# Altium schematic sheet COEXPIX connectors schematics.SchDoc
size A4
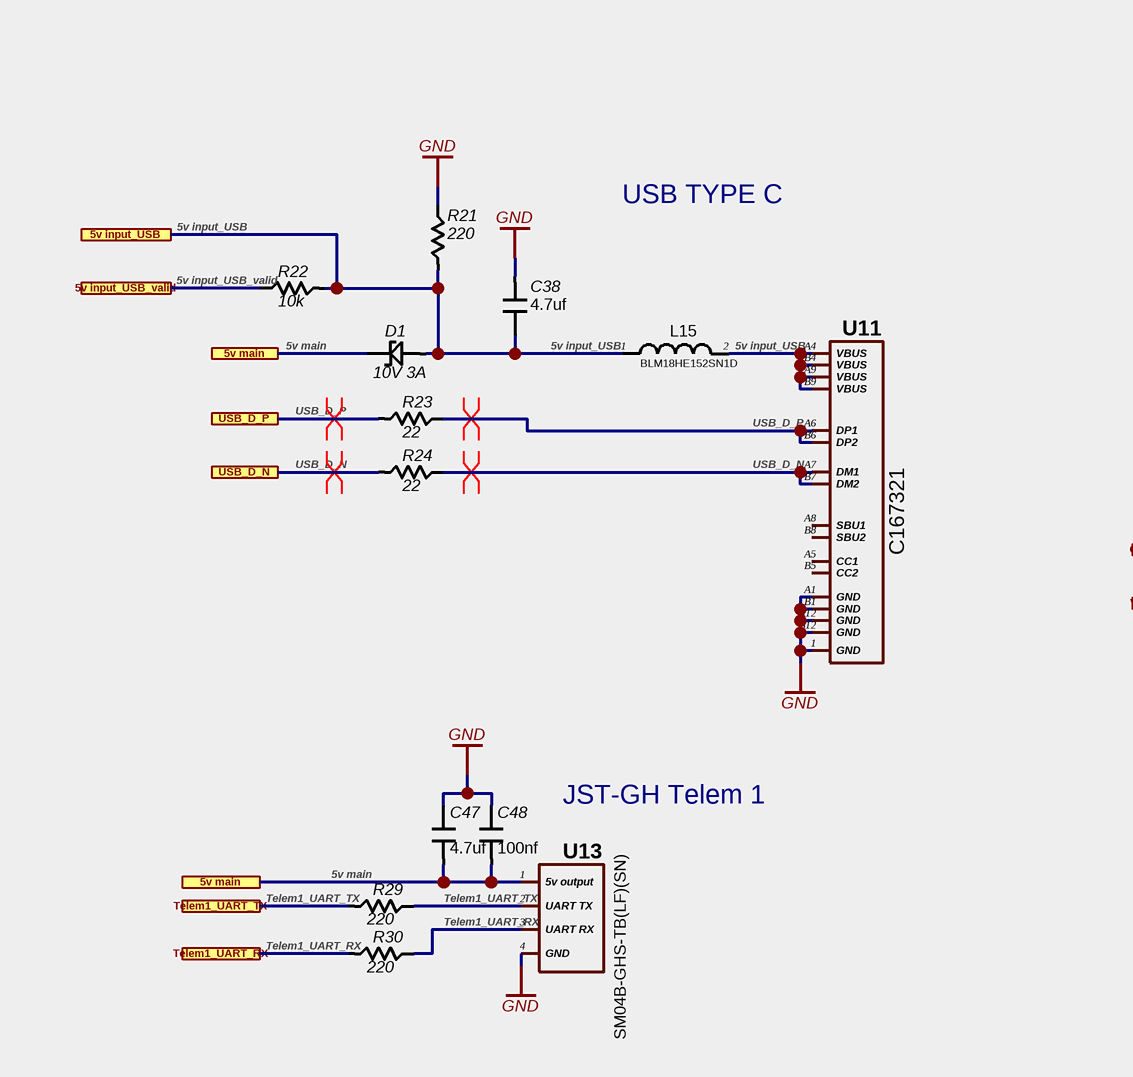
[diagram p0: COEXPIX connectors schematics.SchDoc, top left]
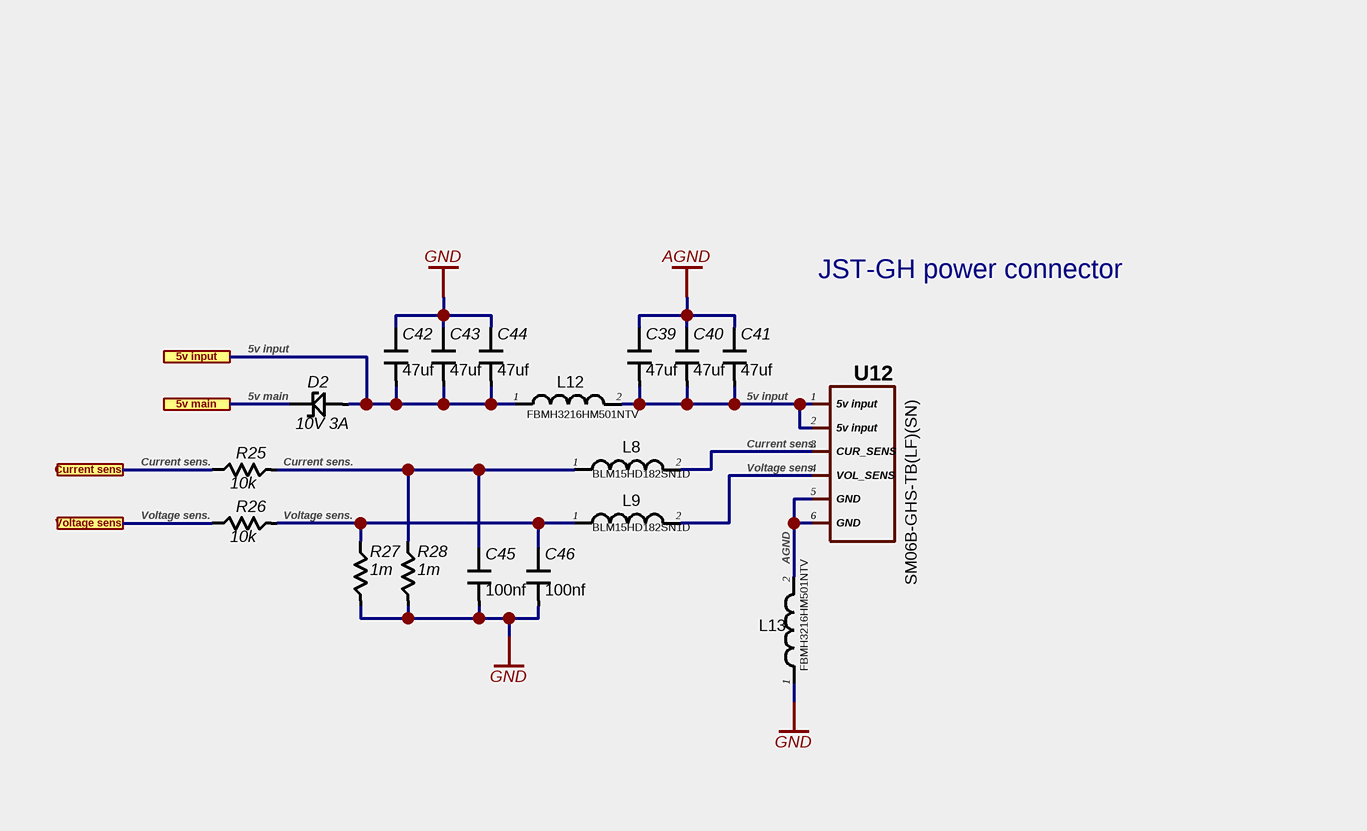
[diagram p1: COEXPIX connectors schematics.SchDoc, top right]
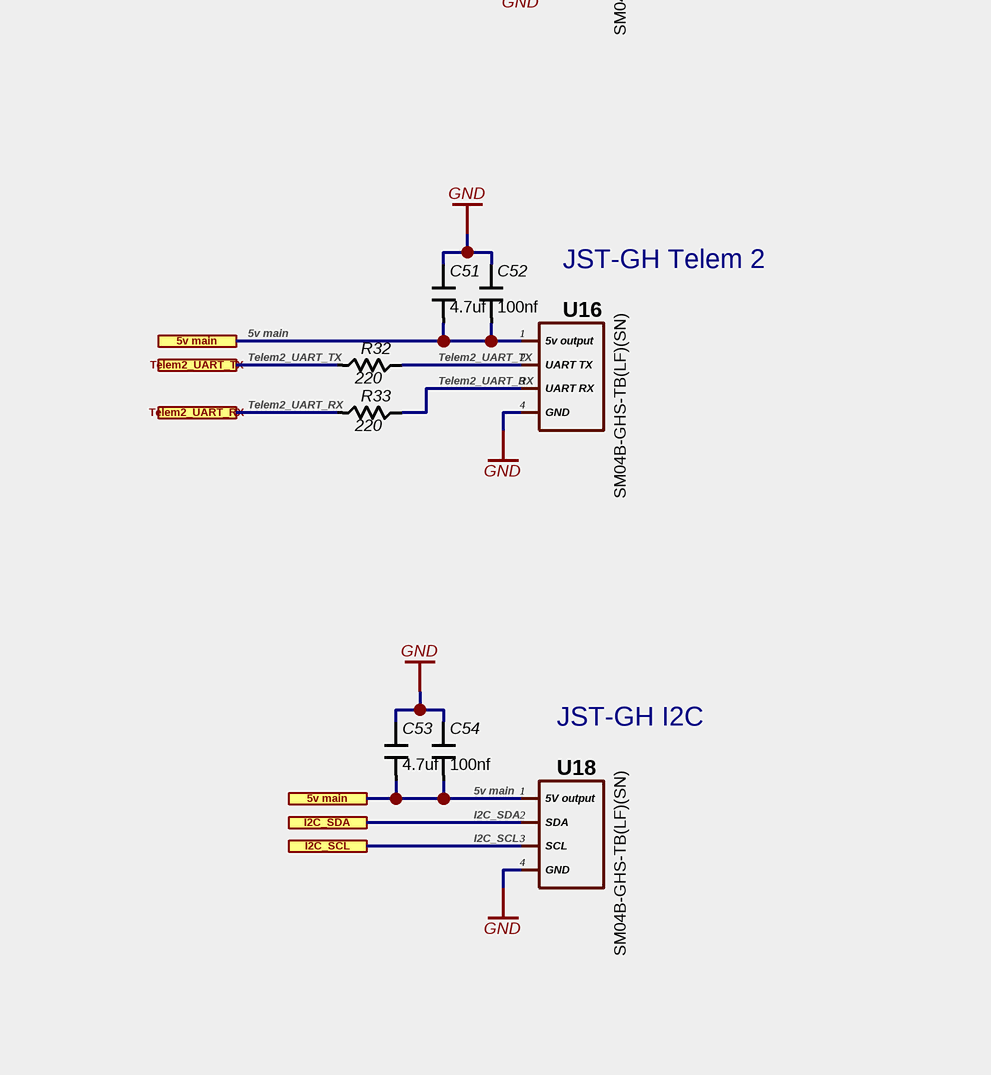
[diagram p2: COEXPIX connectors schematics.SchDoc, bottom left]
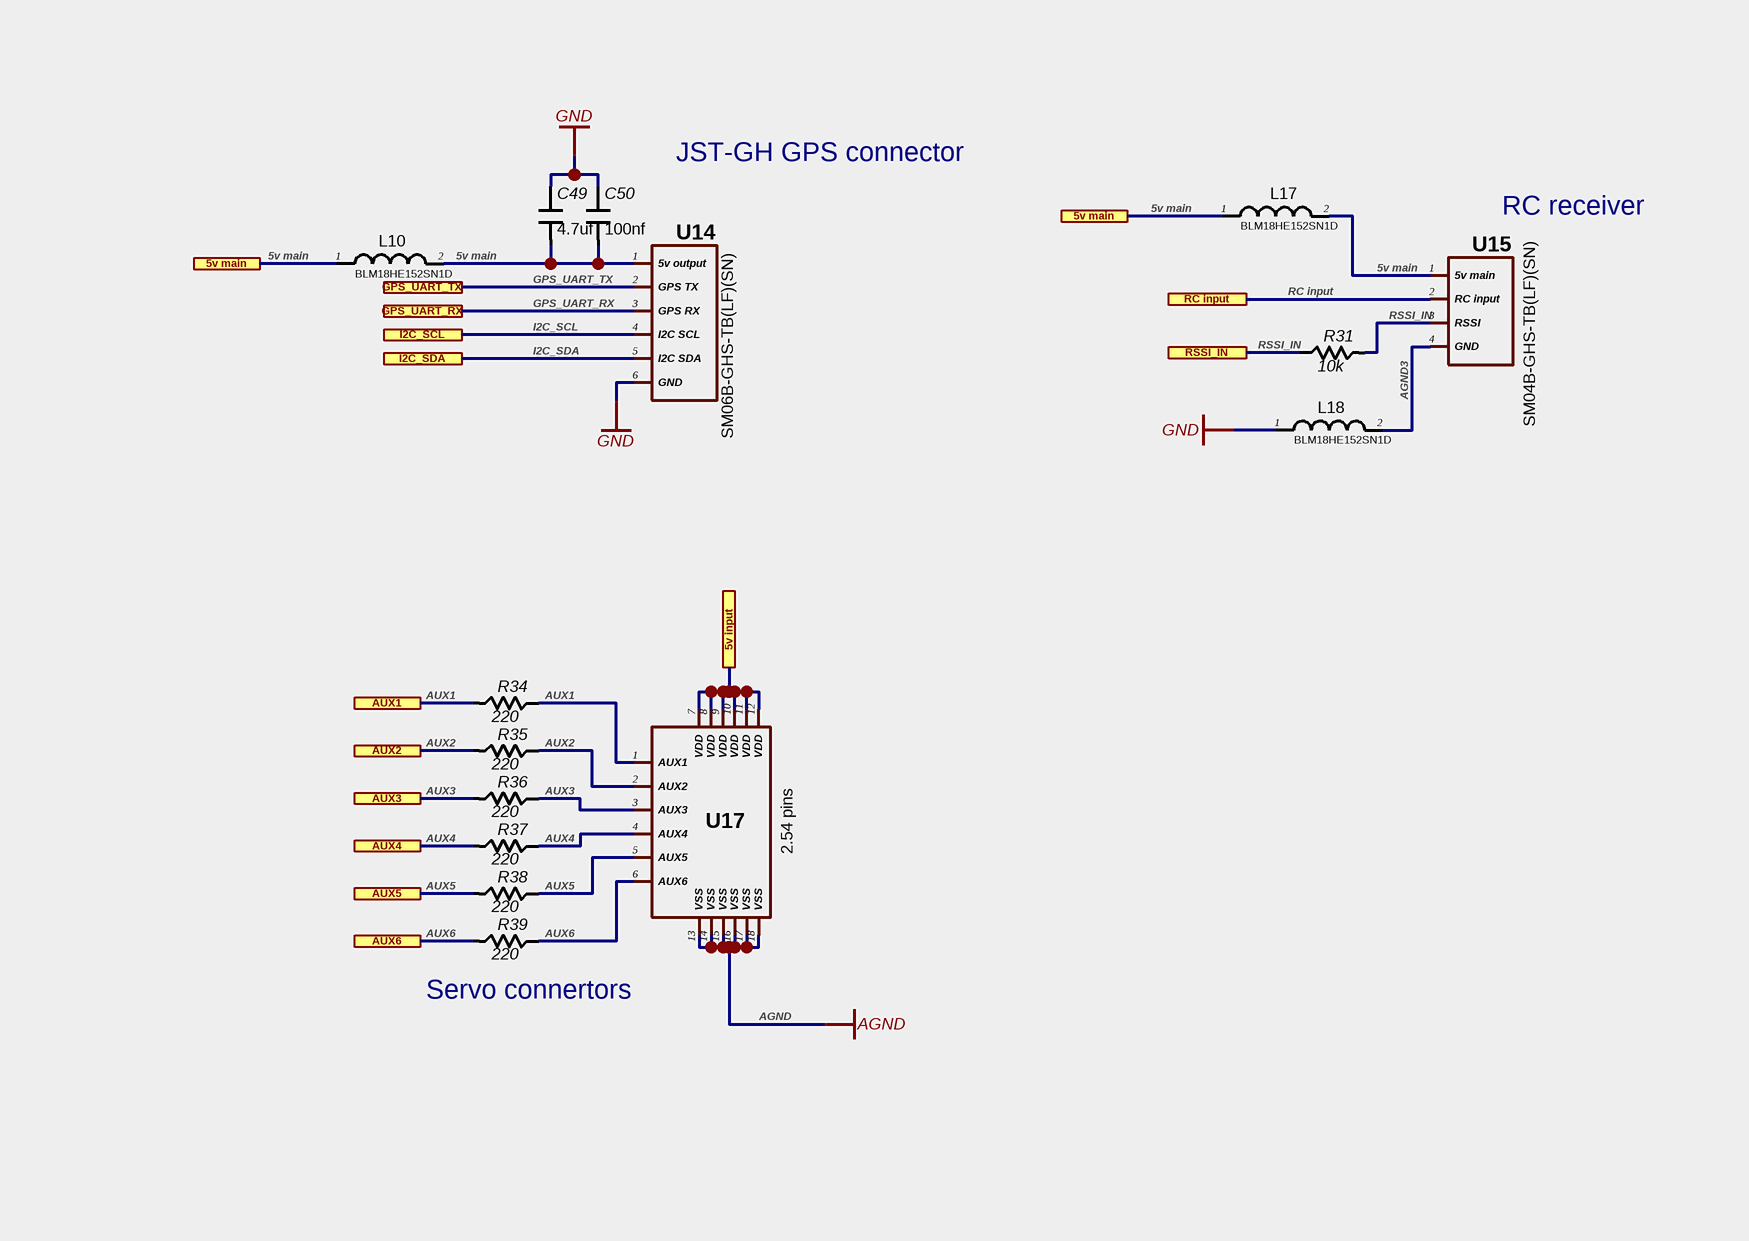
[diagram p3: COEXPIX connectors schematics.SchDoc, bottom right]

## Parts
C38  4.7uf  [Capasitor 0402]
C39  47uf  [Capasitor 0603]
C40  47uf  [Capasitor 0603]
C41  47uf  [Capasitor 0603]
C42  47uf  [Capasitor 0603]
C43  47uf  [Capasitor 0603]
C44  47uf  [Capasitor 0603]
C45  100nf  [Capasitor 0402]
C46  100nf  [Capasitor 0402]
C47  4.7uf  [Capasitor 0402]
C48  100nf  [Capasitor 0402]
C49  4.7uf  [Capasitor 0402]
C50  100nf  [Capasitor 0402]
C51  4.7uf  [Capasitor 0402]
C52  100nf  [Capasitor 0402]
C53  4.7uf  [Capasitor 0402]
C54  100nf  [Capasitor 0402]
D1  10V 3A  [SOD-323F]
D2  10V 3A  [SOD-323F]
L8  BLM15HD182SN1D  [Ferrite bead 0402]
L9  BLM15HD182SN1D  [Ferrite bead 0402]
L10  BLM18HE152SN1D  [Ferrite bead 0603]
L12  FBMH3216HM501NTV  [FERRITE BEAD 1206]
L13  FBMH3216HM501NTV  [FERRITE BEAD 1206]
L15  BLM18HE152SN1D  [Ferrite bead 0603]
L17  BLM18HE152SN1D  [Ferrite bead 0603]
L18  BLM18HE152SN1D  [Ferrite bead 0603]
R21  220  [Resistor 0402]
R22  10k  [Resistor 0402]
R23  22  [Resistor 0402]
R24  22  [Resistor 0402]
R25  10k  [Resistor 0402]
R26  10k  [Resistor 0402]
R27  1m  [Resistor 0402]
R28  1m  [Resistor 0402]
R29  220  [Resistor 0402]
R30  220  [Resistor 0402]
R31  10k  [Resistor 0402]
R32  220  [Resistor 0402]
R33  220  [Resistor 0402]
R34  220  [Resistor 0402]
R35  220  [Resistor 0402]
R36  220  [Resistor 0402]
R37  220  [Resistor 0402]
R38  220  [Resistor 0402]
R39  220  [Resistor 0402]
U11  C167321  [USB TYPE C]
U12  SM06B-GHS-TB(LF)(SN)  [JST-GH 6 PIN]
U13  SM04B-GHS-TB(LF)(SN)  [JST-GH 4 pin]
U14  SM06B-GHS-TB(LF)(SN)  [JST-GH 6 PIN]
U15  SM04B-GHS-TB(LF)(SN)  [JST-GH 4 pin]
U16  SM04B-GHS-TB(LF)(SN)  [JST-GH 4 pin]
U17  2.54 pins  [3x6 PX4 servo array]
U18  SM04B-GHS-TB(LF)(SN)  [JST-GH 4 pin]

## Ports
5v input, 5v input_USB, 5v input_USB_valid, 5v main, AUX1, AUX2, AUX3, AUX4, AUX5, AUX6, Current sens., GPS_UART_RX, GPS_UART_TX, I2C_SCL, I2C_SDA, RC input, RSSI_IN, Telem1_UART_RX, Telem1_UART_TX, Telem2_UART_RX, Telem2_UART_TX, USB_D_N, USB_D_P, Voltage sens.

## Nets
AGND: C39.1 C40.1 C41.1 L13.2 U12.5(GND) U12.6(GND) U17.13(VSS) U17.14(VSS) U17.15(VSS) U17.16(VSS) U17.17(VSS) U17.18(VSS)
GND: C38.2 C42.1 C43.1 C44.1 C45.2 C46.2 C47.1 C48.1 C49.1 C50.1 C51.1 C52.1 C53.1 C54.1 L13.1 L18.1 R21.1 R27.2 R28.2 U11.1(GND) U11.A1(GND) U11.A12(GND) U11.B1(GND) U11.B12(GND) U13.4(GND) U14.6(GND) U16.4(GND) U18.4(GND)
5v input: C39.2 C40.2 C41.2 C42.2 C43.2 C44.2 D2.2 L12.1 L12.2 U12.1(5v_input) U12.2(5v_input) U17.7(VDD) U17.8(VDD) U17.9(VDD) U17.10(VDD) U17.11(VDD) U17.12(VDD) ; port 5v input
5v input_USB: C38.1 D1.2 L15.1 L15.2 R21.2 R22.2 U11.A4(VBUS) U11.A9(VBUS) U11.B4(VBUS) U11.B9(VBUS) ; port 5v input_USB
5v input_USB_valid: R22.1 ; port 5v input_USB_valid
5v main: C47.2 C48.2 C49.2 C50.2 C51.2 C52.2 C53.2 C54.2 D1.1 D2.1 L10.1 L10.2 L17.1 L17.2 U13.1(5v_output) U14.1(5v_output) U15.1(5v_main) U16.1(5v_output) U18.1(5V_output) ; port 5v main
AGND3: L18.2 U15.4(GND)
AUX1: R34.1 R34.2 U17.1(AUX1) ; port AUX1
AUX2: R35.1 R35.2 U17.2(AUX2) ; port AUX2
AUX3: R36.1 R36.2 U17.3(AUX3) ; port AUX3
AUX4: R37.1 R37.2 U17.4(AUX4) ; port AUX4
AUX5: R38.1 R38.2 U17.5(AUX5) ; port AUX5
AUX6: R39.1 R39.2 U17.6(AUX6) ; port AUX6
Current sens.: C45.1 L8.1 L8.2 R25.1 R25.2 R28.1 U12.3(CUR_SENS) ; port Current sens.
GPS_UART_RX: U14.3(GPS_RX) ; port GPS_UART_RX
GPS_UART_TX: U14.2(GPS_TX) ; port GPS_UART_TX
I2C_SCL: U14.4(I2C_SCL) U18.3(SCL) ; port I2C_SCL
I2C_SDA: U14.5(I2C_SDA) U18.2(SDA) ; port I2C_SDA
RC input: U15.2(RC_input) ; port RC input
RSSI_IN: R31.1 R31.2 U15.3(RSSI) ; port RSSI_IN
Telem1_UART_RX: R30.1 R30.2 U13.3(UART_RX) ; port Telem1_UART_RX
Telem1_UART_TX: R29.1 R29.2 U13.2(UART_TX) ; port Telem1_UART_TX
Telem2_UART_RX: R33.1 R33.2 U16.3(UART_RX) ; port Telem2_UART_RX
Telem2_UART_TX: R32.1 R32.2 U16.2(UART_TX) ; port Telem2_UART_TX
USB_D_N: R24.1 R24.2 U11.A7(DM1) U11.B7(DM2) ; port USB_D_N
USB_D_P: R23.1 R23.2 U11.A6(DP1) U11.B6(DP2) ; port USB_D_P
Voltage sens.: C46.1 L9.1 L9.2 R26.1 R26.2 R27.1 U12.4(VOL_SENS) ; port Voltage sens.

Not connected (* = marked no-connect by the designer): U11 A5(CC1) A8(SBU1) B5(CC2) B8(SBU2)

## Layout directives
differential pair: USB_D_N, USB_D_P

## Notes on the sheet
- USB TYPE C
- JST-GH power connector
- JST-GH Telem 1
- JST-GH GPS connector
- (near U15) RC receiver
- JST-GH Telem 2
- (near U18) JST-GH I2C
- Servo connertors

## Library data of the parts
C38 C47 C49 C51 C53 = Capacitor MLCC: 4.7uF ±20% 6.3V X5R 0402 Multilayer Ceramic Capacitor; Part number: JMK105BBJ475MV-F; Manufacturer: Taiyo Yuden; Component package: 0402; HelpURL: https://lcsc.com/product-detail/Multilayer-Ceramic-Capacitors-MLCC-SMD-SMT_TAIYO-YUDEN_JMK105BBJ475MV-F_4-7uF-475-20-6-3V_C87147.html; Value: 4.7uf
C39-C44 = Capacitor MLCC: Multilayer Ceramic Capacitors MLCC - SMD/SMT 47uF 6.3V 0603; Part number: GRM188R60J476ME15D; Manufacturer: Murata; Component package: 0603; HelpURL: https://lcsc.com/product-detail/Multilayer-Ceramic-Capacitors-MLCC-SMD-SMT_MuRata_GRM188R60J476ME15D_47uF-476-20-6-3V_C140782.html; Value: 47uf
C45 C46 C48 C50 C52 C54 = Capacitor MLCC: Multilayer Ceramic Capacitors MLCC - SMD/SMT 100nF 16V 0402; Part number: CC0402KRX7R7BB104; Manufacturer: YAGEO; Component package: 0402; HelpURL: https://lcsc.com/product-detail/Multilayer-Ceramic-Capacitors-MLCC-SMD-SMT_100nF-104-10-16V_C60474.html; Value: 100nf
D1 D2 = Schottky barrier diode: 10V 3A 580mV @ 1A SOD-323 Schottky Barrier Diode; Part number: BAT60JFILM; Manufacturer: STMicroelectronics; HelpURL: https://lcsc.com/product-detail/Schottky-Barrier-Diodes-SBD_STMicroelectronics_BAT60JFILM_BAT60JFILM_C133103.html; Component package: SOD-323; Value: 10V 3A
L8 L9 = FB / Inductor: Beads 0402; Manufacturer: Murata Electronics; Component package: 0402; Value: 1.8 kOhm @100MHz; Part number: BLM15HD182SN1D; HelpURL: https://lcsc.com/product-detail/Ferrite-Beads-And-Chips_MuRata_BLM15HD182SN1D_1-8KR-at100MHz_C76888.html
L10 L15 L17 L18 = FB / Inductor: 1.5kΩ @ 100MHz 500mA 1 500mΩ 0603 Ferrite Bead; Manufacturer: Murata; Component package: 0603; Value: 1.5 kOhm @100MHz; Part number: BLM18HE152SN1D; HelpURL: https://lcsc.com/product-detail/Ferrite-Beads-And-Chips_muRata_BLM18HE152SN1D_1-5KR-25-at100MHz_C82155.html
L12 L13 = FB / Inductor: 500Ω @ 100MHz 2A 1 70mΩ 1206 Ferrite Bead; Manufacturer: Taiyo Yuden; Component package: 1206; Part number: FBMH3216HM501NTV; HelpURL: https://lcsc.com/product-detail/Ferrite-Beads_Taiyo-Yuden-FBMH3216HM501NTV_C515371.html
R21 R29 R30 R32-R39 = Resistor: Chip Resistor - Surface Mount 220Ohms ±1% 1/16W 040; Part number: 0402WGF2200TCE; Manufacturer: Uniroyal Elec; Component package: 0402; HelpURL: https://lcsc.com/product-detail/Chip-Resistor-Surface-Mount_Uniroyal-Elec-0402WGF2200TCE_C25091.html; Value: 220
R22 R25 R26 R31 = Resistor: Chip Resistor - Surface Mount 10KOhms ±1% 1/16W 0402; Part number: RC0402FR-0710KL; Manufacturer: YAGEO; Component package: 0402; HelpURL: https://lcsc.com/product-detail/Chip-Resistor-Surface-Mount_10KR-1002-1_C60490.html; Value: 10k
R23 R24 = Resistor: Chip Resistor - Surface Mount 22Ohms ±1% 1/16W 0402; Part number: RC0402FR-0722RL; Manufacturer: YAGEO; Component package: 0402; HelpURL: https://lcsc.com/product-detail/Chip-Resistor-Surface-Mount_22R-22R0-1_C114765.html; Value: 22
R27 R28 = Resistor: 1M ±1% 1/16W ±100ppm/°C 0402 Chip Resistor; Part number: RC0402FR-071ML; Manufacturer: YAGEO; Component package: 0402; HelpURL: https://lcsc.com/product-detail/Chip-Resistor-Surface-Mount_1MR-1004-1_C138033.html; Value: 1m
U11 = USB type C: USB - Type C Receptacle 12 SMD USB Connector; Manufacturer: Jing Extension of the Electronic Co.; Part number: C167321; HelpURL: https://lcsc.com/product-detail/USB-Connectors_Jing-Extension-of-the-Electronic-Co-C167321_C167321.html
U12 U14 = JST-GH 6: Wire To Board / Wire To Wire Connector SMD; Manufacturer: JST Sales America; Part number: SM06B-GHS-TB(LF)(SN); HelpURL: https://lcsc.com/product-detail/Wire-To-Board-Wire-To-Wire-Connector_JST-Sales-America_SM06B-GHS-TB-LF-SN_JST-Sales-America-SM06B-GHS-TB-LF-SN_C133065.html
U13 = JST-GH 4: GH Header Outer Shroud Contact 0.049"(1.25mm) 4 SMD,P=1.25mm Wire To Board / Wire To Wire Connector; Manufacturer: JST Sales America; Component package: socket P=1.25mm; Part number: SM04B-GHS-TB(LF)(SN); HelpURL: https://lcsc.com/product-detail/Wire-To-Board-Wire-To-Wire-Connector_JST-Sales-America_SM04B-GHS-TB-LF-SN_JST-Sales-America-SM04B-GHS-TB-LF-SN_C189895.html
U15 U16 U18 = JST-GH 4: Wire To Board / Wire To Wire Connector socket P=1.25mm; Manufacturer: JST Sales America; Part number: SM04B-GHS-TB(LF)(SN); HelpURL: https://lcsc.com/product-detail/Wire-To-Board-Wire-To-Wire-Connector_JST-Sales-America_SM04B-GHS-TB-LF-SN_JST-Sales-America-SM04B-GHS-TB-LF-SN_C189895.html; Component package: socket P=1.25mm
U17 = 3x6 dupont pins: Part number: 2.54 pins array; HelpURL: https://ru.aliexpress.com/item/32702387665.html?spm=a2g0s.9042311.0.0.274233edguG5tO